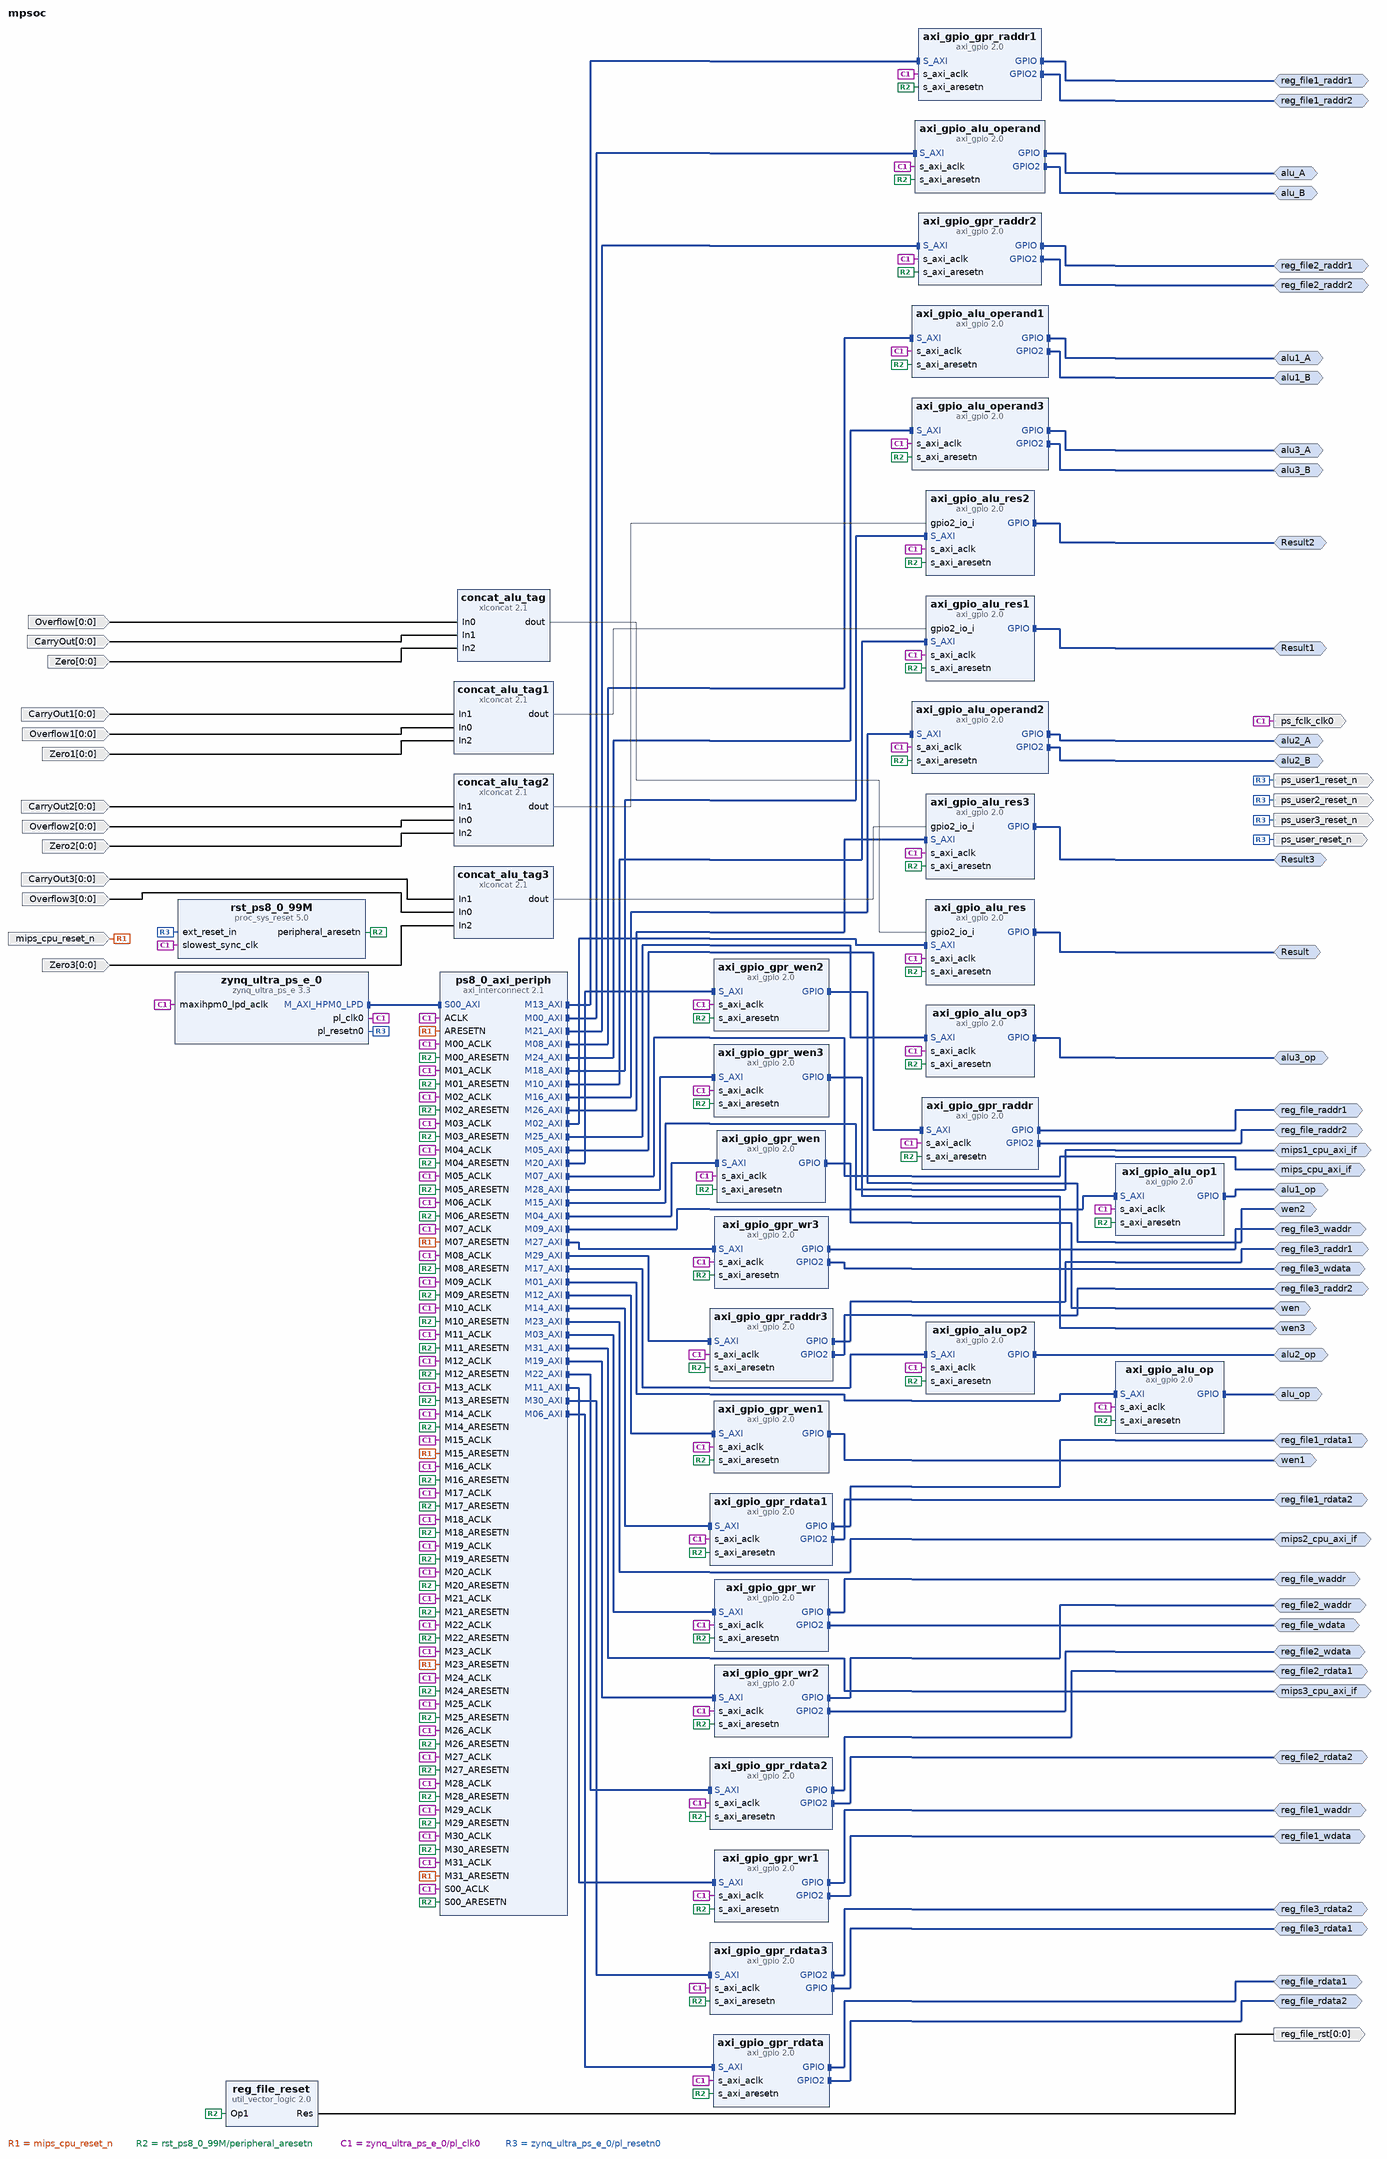
[diagram p0: block diagram of the top level]
# Vivado block design mpsoc, xczu19eg-ffvc1760-2-i, Vivado 2019.1
create_bd_design mpsoc

create_bd_intf_port -mode Master -vlnv xilinx.com:interface:gpio_rtl:1.0 Result
create_bd_intf_port -mode Master -vlnv xilinx.com:interface:gpio_rtl:1.0 Result1
create_bd_intf_port -mode Master -vlnv xilinx.com:interface:gpio_rtl:1.0 Result2
create_bd_intf_port -mode Master -vlnv xilinx.com:interface:gpio_rtl:1.0 Result3
create_bd_intf_port -mode Master -vlnv xilinx.com:interface:gpio_rtl:1.0 alu1_A
create_bd_intf_port -mode Master -vlnv xilinx.com:interface:gpio_rtl:1.0 alu1_B
create_bd_intf_port -mode Master -vlnv xilinx.com:interface:gpio_rtl:1.0 alu1_op
create_bd_intf_port -mode Master -vlnv xilinx.com:interface:gpio_rtl:1.0 alu2_A
create_bd_intf_port -mode Master -vlnv xilinx.com:interface:gpio_rtl:1.0 alu2_B
create_bd_intf_port -mode Master -vlnv xilinx.com:interface:gpio_rtl:1.0 alu2_op
create_bd_intf_port -mode Master -vlnv xilinx.com:interface:gpio_rtl:1.0 alu3_A
create_bd_intf_port -mode Master -vlnv xilinx.com:interface:gpio_rtl:1.0 alu3_B
create_bd_intf_port -mode Master -vlnv xilinx.com:interface:gpio_rtl:1.0 alu3_op
create_bd_intf_port -mode Master -vlnv xilinx.com:interface:gpio_rtl:1.0 alu_A
create_bd_intf_port -mode Master -vlnv xilinx.com:interface:gpio_rtl:1.0 alu_B
create_bd_intf_port -mode Master -vlnv xilinx.com:interface:gpio_rtl:1.0 alu_op
create_bd_intf_port -mode Master -vlnv xilinx.com:interface:aximm_rtl:1.0 mips1_cpu_axi_if
set_property -dict {CONFIG.ADDR_WIDTH 32 CONFIG.DATA_WIDTH 32 CONFIG.PROTOCOL AXI4LITE} [get_bd_intf_ports mips1_cpu_axi_if]
create_bd_intf_port -mode Master -vlnv xilinx.com:interface:aximm_rtl:1.0 mips2_cpu_axi_if
set_property -dict {CONFIG.ADDR_WIDTH 32 CONFIG.DATA_WIDTH 32 CONFIG.PROTOCOL AXI4LITE} [get_bd_intf_ports mips2_cpu_axi_if]
create_bd_intf_port -mode Master -vlnv xilinx.com:interface:aximm_rtl:1.0 mips3_cpu_axi_if
set_property -dict {CONFIG.ADDR_WIDTH 32 CONFIG.DATA_WIDTH 32 CONFIG.PROTOCOL AXI4LITE} [get_bd_intf_ports mips3_cpu_axi_if]
create_bd_intf_port -mode Master -vlnv xilinx.com:interface:aximm_rtl:1.0 mips_cpu_axi_if
set_property -dict {CONFIG.ADDR_WIDTH 32 CONFIG.DATA_WIDTH 32 CONFIG.PROTOCOL AXI4LITE} [get_bd_intf_ports mips_cpu_axi_if]
create_bd_intf_port -mode Master -vlnv xilinx.com:interface:gpio_rtl:1.0 reg_file1_raddr1
create_bd_intf_port -mode Master -vlnv xilinx.com:interface:gpio_rtl:1.0 reg_file1_raddr2
create_bd_intf_port -mode Master -vlnv xilinx.com:interface:gpio_rtl:1.0 reg_file1_rdata1
create_bd_intf_port -mode Master -vlnv xilinx.com:interface:gpio_rtl:1.0 reg_file1_rdata2
create_bd_intf_port -mode Master -vlnv xilinx.com:interface:gpio_rtl:1.0 reg_file1_waddr
create_bd_intf_port -mode Master -vlnv xilinx.com:interface:gpio_rtl:1.0 reg_file1_wdata
create_bd_intf_port -mode Master -vlnv xilinx.com:interface:gpio_rtl:1.0 reg_file2_raddr1
create_bd_intf_port -mode Master -vlnv xilinx.com:interface:gpio_rtl:1.0 reg_file2_raddr2
create_bd_intf_port -mode Master -vlnv xilinx.com:interface:gpio_rtl:1.0 reg_file2_rdata1
create_bd_intf_port -mode Master -vlnv xilinx.com:interface:gpio_rtl:1.0 reg_file2_rdata2
create_bd_intf_port -mode Master -vlnv xilinx.com:interface:gpio_rtl:1.0 reg_file2_waddr
create_bd_intf_port -mode Master -vlnv xilinx.com:interface:gpio_rtl:1.0 reg_file2_wdata
create_bd_intf_port -mode Master -vlnv xilinx.com:interface:gpio_rtl:1.0 reg_file3_raddr1
create_bd_intf_port -mode Master -vlnv xilinx.com:interface:gpio_rtl:1.0 reg_file3_raddr2
create_bd_intf_port -mode Master -vlnv xilinx.com:interface:gpio_rtl:1.0 reg_file3_rdata1
create_bd_intf_port -mode Master -vlnv xilinx.com:interface:gpio_rtl:1.0 reg_file3_rdata2
create_bd_intf_port -mode Master -vlnv xilinx.com:interface:gpio_rtl:1.0 reg_file3_waddr
create_bd_intf_port -mode Master -vlnv xilinx.com:interface:gpio_rtl:1.0 reg_file3_wdata
create_bd_intf_port -mode Master -vlnv xilinx.com:interface:gpio_rtl:1.0 reg_file_raddr1
create_bd_intf_port -mode Master -vlnv xilinx.com:interface:gpio_rtl:1.0 reg_file_raddr2
create_bd_intf_port -mode Master -vlnv xilinx.com:interface:gpio_rtl:1.0 reg_file_rdata1
create_bd_intf_port -mode Master -vlnv xilinx.com:interface:gpio_rtl:1.0 reg_file_rdata2
create_bd_intf_port -mode Master -vlnv xilinx.com:interface:gpio_rtl:1.0 reg_file_waddr
create_bd_intf_port -mode Master -vlnv xilinx.com:interface:gpio_rtl:1.0 reg_file_wdata
create_bd_intf_port -mode Master -vlnv xilinx.com:interface:gpio_rtl:1.0 wen
create_bd_intf_port -mode Master -vlnv xilinx.com:interface:gpio_rtl:1.0 wen1
create_bd_intf_port -mode Master -vlnv xilinx.com:interface:gpio_rtl:1.0 wen2
create_bd_intf_port -mode Master -vlnv xilinx.com:interface:gpio_rtl:1.0 wen3
create_bd_port -dir I -from 0 -to 0 CarryOut
create_bd_port -dir I -from 0 -to 0 CarryOut1
create_bd_port -dir I -from 0 -to 0 CarryOut2
create_bd_port -dir I -from 0 -to 0 CarryOut3
create_bd_port -dir I -from 0 -to 0 Overflow
create_bd_port -dir I -from 0 -to 0 Overflow1
create_bd_port -dir I -from 0 -to 0 Overflow2
create_bd_port -dir I -from 0 -to 0 Overflow3
create_bd_port -dir I -from 0 -to 0 Zero
create_bd_port -dir I -from 0 -to 0 Zero1
create_bd_port -dir I -from 0 -to 0 Zero2
create_bd_port -dir I -from 0 -to 0 Zero3
create_bd_port -dir I -type rst mips_cpu_reset_n
create_bd_port -dir O -type clk ps_fclk_clk0
set_property -dict [list \
  CONFIG.ASSOCIATED_BUSIF mips_cpu_axi_if:mips1_cpu_axi_if:mips2_cpu_axi_if:mips3_cpu_axi_if \
  CONFIG.ASSOCIATED_RESET mips_cpu_reset_n:ps_user_reset_n:ps_user1_reset_n:ps_user2_reset_n:ps_user3_reset_n \
] [get_bd_ports ps_fclk_clk0]
create_bd_port -dir O -type rst ps_user1_reset_n
create_bd_port -dir O -type rst ps_user2_reset_n
create_bd_port -dir O -type rst ps_user3_reset_n
create_bd_port -dir O -type rst ps_user_reset_n
create_bd_port -dir O -from 0 -to 0 reg_file_rst

create_bd_cell -type ip -vlnv xilinx.com:ip:axi_gpio:2.0 axi_gpio_alu_op
set_property -dict {CONFIG.C_ALL_INPUTS 0 CONFIG.C_ALL_OUTPUTS 1 CONFIG.C_GPIO_WIDTH 3} [get_bd_cells axi_gpio_alu_op]
create_bd_cell -type ip -vlnv xilinx.com:ip:axi_gpio:2.0 axi_gpio_alu_op1
set_property -dict {CONFIG.C_ALL_INPUTS 0 CONFIG.C_ALL_OUTPUTS 1 CONFIG.C_GPIO_WIDTH 3} [get_bd_cells axi_gpio_alu_op1]
create_bd_cell -type ip -vlnv xilinx.com:ip:axi_gpio:2.0 axi_gpio_alu_op2
set_property -dict {CONFIG.C_ALL_INPUTS 0 CONFIG.C_ALL_OUTPUTS 1 CONFIG.C_GPIO_WIDTH 3} [get_bd_cells axi_gpio_alu_op2]
create_bd_cell -type ip -vlnv xilinx.com:ip:axi_gpio:2.0 axi_gpio_alu_op3
set_property -dict {CONFIG.C_ALL_INPUTS 0 CONFIG.C_ALL_OUTPUTS 1 CONFIG.C_GPIO_WIDTH 3} [get_bd_cells axi_gpio_alu_op3]
create_bd_cell -type ip -vlnv xilinx.com:ip:axi_gpio:2.0 axi_gpio_alu_operand
set_property -dict [list \
  CONFIG.C_ALL_INPUTS 0 \
  CONFIG.C_ALL_INPUTS_2 0 \
  CONFIG.C_ALL_OUTPUTS 1 \
  CONFIG.C_ALL_OUTPUTS_2 1 \
  CONFIG.C_GPIO2_WIDTH 32 \
  CONFIG.C_GPIO_WIDTH 32 \
  CONFIG.C_IS_DUAL 1 \
] [get_bd_cells axi_gpio_alu_operand]
create_bd_cell -type ip -vlnv xilinx.com:ip:axi_gpio:2.0 axi_gpio_alu_operand1
set_property -dict [list \
  CONFIG.C_ALL_INPUTS 0 \
  CONFIG.C_ALL_INPUTS_2 0 \
  CONFIG.C_ALL_OUTPUTS 1 \
  CONFIG.C_ALL_OUTPUTS_2 1 \
  CONFIG.C_GPIO2_WIDTH 32 \
  CONFIG.C_GPIO_WIDTH 32 \
  CONFIG.C_IS_DUAL 1 \
] [get_bd_cells axi_gpio_alu_operand1]
create_bd_cell -type ip -vlnv xilinx.com:ip:axi_gpio:2.0 axi_gpio_alu_operand2
set_property -dict [list \
  CONFIG.C_ALL_INPUTS 0 \
  CONFIG.C_ALL_INPUTS_2 0 \
  CONFIG.C_ALL_OUTPUTS 1 \
  CONFIG.C_ALL_OUTPUTS_2 1 \
  CONFIG.C_GPIO2_WIDTH 32 \
  CONFIG.C_GPIO_WIDTH 32 \
  CONFIG.C_IS_DUAL 1 \
] [get_bd_cells axi_gpio_alu_operand2]
create_bd_cell -type ip -vlnv xilinx.com:ip:axi_gpio:2.0 axi_gpio_alu_operand3
set_property -dict [list \
  CONFIG.C_ALL_INPUTS 0 \
  CONFIG.C_ALL_INPUTS_2 0 \
  CONFIG.C_ALL_OUTPUTS 1 \
  CONFIG.C_ALL_OUTPUTS_2 1 \
  CONFIG.C_GPIO2_WIDTH 32 \
  CONFIG.C_GPIO_WIDTH 32 \
  CONFIG.C_IS_DUAL 1 \
] [get_bd_cells axi_gpio_alu_operand3]
create_bd_cell -type ip -vlnv xilinx.com:ip:axi_gpio:2.0 axi_gpio_alu_res
set_property -dict [list \
  CONFIG.C_ALL_INPUTS 1 \
  CONFIG.C_ALL_INPUTS_2 1 \
  CONFIG.C_GPIO2_WIDTH 3 \
  CONFIG.C_GPIO_WIDTH 32 \
  CONFIG.C_IS_DUAL 1 \
] [get_bd_cells axi_gpio_alu_res]
create_bd_cell -type ip -vlnv xilinx.com:ip:axi_gpio:2.0 axi_gpio_alu_res1
set_property -dict [list \
  CONFIG.C_ALL_INPUTS 1 \
  CONFIG.C_ALL_INPUTS_2 1 \
  CONFIG.C_GPIO2_WIDTH 3 \
  CONFIG.C_GPIO_WIDTH 32 \
  CONFIG.C_IS_DUAL 1 \
] [get_bd_cells axi_gpio_alu_res1]
create_bd_cell -type ip -vlnv xilinx.com:ip:axi_gpio:2.0 axi_gpio_alu_res2
set_property -dict [list \
  CONFIG.C_ALL_INPUTS 1 \
  CONFIG.C_ALL_INPUTS_2 1 \
  CONFIG.C_GPIO2_WIDTH 3 \
  CONFIG.C_GPIO_WIDTH 32 \
  CONFIG.C_IS_DUAL 1 \
] [get_bd_cells axi_gpio_alu_res2]
create_bd_cell -type ip -vlnv xilinx.com:ip:axi_gpio:2.0 axi_gpio_alu_res3
set_property -dict [list \
  CONFIG.C_ALL_INPUTS 1 \
  CONFIG.C_ALL_INPUTS_2 1 \
  CONFIG.C_GPIO2_WIDTH 3 \
  CONFIG.C_GPIO_WIDTH 32 \
  CONFIG.C_IS_DUAL 1 \
] [get_bd_cells axi_gpio_alu_res3]
create_bd_cell -type ip -vlnv xilinx.com:ip:axi_gpio:2.0 axi_gpio_gpr_raddr
set_property -dict [list \
  CONFIG.C_ALL_INPUTS 0 \
  CONFIG.C_ALL_INPUTS_2 0 \
  CONFIG.C_ALL_OUTPUTS 1 \
  CONFIG.C_ALL_OUTPUTS_2 1 \
  CONFIG.C_GPIO2_WIDTH 5 \
  CONFIG.C_GPIO_WIDTH 5 \
  CONFIG.C_IS_DUAL 1 \
] [get_bd_cells axi_gpio_gpr_raddr]
create_bd_cell -type ip -vlnv xilinx.com:ip:axi_gpio:2.0 axi_gpio_gpr_raddr1
set_property -dict [list \
  CONFIG.C_ALL_INPUTS 0 \
  CONFIG.C_ALL_INPUTS_2 0 \
  CONFIG.C_ALL_OUTPUTS 1 \
  CONFIG.C_ALL_OUTPUTS_2 1 \
  CONFIG.C_GPIO2_WIDTH 5 \
  CONFIG.C_GPIO_WIDTH 5 \
  CONFIG.C_IS_DUAL 1 \
] [get_bd_cells axi_gpio_gpr_raddr1]
create_bd_cell -type ip -vlnv xilinx.com:ip:axi_gpio:2.0 axi_gpio_gpr_raddr2
set_property -dict [list \
  CONFIG.C_ALL_INPUTS 0 \
  CONFIG.C_ALL_INPUTS_2 0 \
  CONFIG.C_ALL_OUTPUTS 1 \
  CONFIG.C_ALL_OUTPUTS_2 1 \
  CONFIG.C_GPIO2_WIDTH 5 \
  CONFIG.C_GPIO_WIDTH 5 \
  CONFIG.C_IS_DUAL 1 \
] [get_bd_cells axi_gpio_gpr_raddr2]
create_bd_cell -type ip -vlnv xilinx.com:ip:axi_gpio:2.0 axi_gpio_gpr_raddr3
set_property -dict [list \
  CONFIG.C_ALL_INPUTS 0 \
  CONFIG.C_ALL_INPUTS_2 0 \
  CONFIG.C_ALL_OUTPUTS 1 \
  CONFIG.C_ALL_OUTPUTS_2 1 \
  CONFIG.C_GPIO2_WIDTH 5 \
  CONFIG.C_GPIO_WIDTH 5 \
  CONFIG.C_IS_DUAL 1 \
] [get_bd_cells axi_gpio_gpr_raddr3]
create_bd_cell -type ip -vlnv xilinx.com:ip:axi_gpio:2.0 axi_gpio_gpr_rdata
set_property -dict [list \
  CONFIG.C_ALL_INPUTS 1 \
  CONFIG.C_ALL_INPUTS_2 1 \
  CONFIG.C_GPIO2_WIDTH 32 \
  CONFIG.C_GPIO_WIDTH 32 \
  CONFIG.C_IS_DUAL 1 \
] [get_bd_cells axi_gpio_gpr_rdata]
create_bd_cell -type ip -vlnv xilinx.com:ip:axi_gpio:2.0 axi_gpio_gpr_rdata1
set_property -dict [list \
  CONFIG.C_ALL_INPUTS 1 \
  CONFIG.C_ALL_INPUTS_2 1 \
  CONFIG.C_GPIO2_WIDTH 32 \
  CONFIG.C_GPIO_WIDTH 32 \
  CONFIG.C_IS_DUAL 1 \
] [get_bd_cells axi_gpio_gpr_rdata1]
create_bd_cell -type ip -vlnv xilinx.com:ip:axi_gpio:2.0 axi_gpio_gpr_rdata2
set_property -dict [list \
  CONFIG.C_ALL_INPUTS 1 \
  CONFIG.C_ALL_INPUTS_2 1 \
  CONFIG.C_GPIO2_WIDTH 32 \
  CONFIG.C_GPIO_WIDTH 32 \
  CONFIG.C_IS_DUAL 1 \
] [get_bd_cells axi_gpio_gpr_rdata2]
create_bd_cell -type ip -vlnv xilinx.com:ip:axi_gpio:2.0 axi_gpio_gpr_rdata3
set_property -dict [list \
  CONFIG.C_ALL_INPUTS 1 \
  CONFIG.C_ALL_INPUTS_2 1 \
  CONFIG.C_GPIO2_WIDTH 32 \
  CONFIG.C_GPIO_WIDTH 32 \
  CONFIG.C_IS_DUAL 1 \
] [get_bd_cells axi_gpio_gpr_rdata3]
create_bd_cell -type ip -vlnv xilinx.com:ip:axi_gpio:2.0 axi_gpio_gpr_wen
set_property -dict {CONFIG.C_ALL_INPUTS 0 CONFIG.C_ALL_OUTPUTS 1 CONFIG.C_GPIO_WIDTH 1} [get_bd_cells axi_gpio_gpr_wen]
create_bd_cell -type ip -vlnv xilinx.com:ip:axi_gpio:2.0 axi_gpio_gpr_wen1
set_property -dict {CONFIG.C_ALL_INPUTS 0 CONFIG.C_ALL_OUTPUTS 1 CONFIG.C_GPIO_WIDTH 1} [get_bd_cells axi_gpio_gpr_wen1]
create_bd_cell -type ip -vlnv xilinx.com:ip:axi_gpio:2.0 axi_gpio_gpr_wen2
set_property -dict {CONFIG.C_ALL_INPUTS 0 CONFIG.C_ALL_OUTPUTS 1 CONFIG.C_GPIO_WIDTH 1} [get_bd_cells axi_gpio_gpr_wen2]
create_bd_cell -type ip -vlnv xilinx.com:ip:axi_gpio:2.0 axi_gpio_gpr_wen3
set_property -dict {CONFIG.C_ALL_INPUTS 0 CONFIG.C_ALL_OUTPUTS 1 CONFIG.C_GPIO_WIDTH 1} [get_bd_cells axi_gpio_gpr_wen3]
create_bd_cell -type ip -vlnv xilinx.com:ip:axi_gpio:2.0 axi_gpio_gpr_wr
set_property -dict [list \
  CONFIG.C_ALL_INPUTS 0 \
  CONFIG.C_ALL_INPUTS_2 0 \
  CONFIG.C_ALL_OUTPUTS 1 \
  CONFIG.C_ALL_OUTPUTS_2 1 \
  CONFIG.C_GPIO2_WIDTH 32 \
  CONFIG.C_GPIO_WIDTH 5 \
  CONFIG.C_IS_DUAL 1 \
] [get_bd_cells axi_gpio_gpr_wr]
create_bd_cell -type ip -vlnv xilinx.com:ip:axi_gpio:2.0 axi_gpio_gpr_wr1
set_property -dict [list \
  CONFIG.C_ALL_INPUTS 0 \
  CONFIG.C_ALL_INPUTS_2 0 \
  CONFIG.C_ALL_OUTPUTS 1 \
  CONFIG.C_ALL_OUTPUTS_2 1 \
  CONFIG.C_GPIO2_WIDTH 32 \
  CONFIG.C_GPIO_WIDTH 5 \
  CONFIG.C_IS_DUAL 1 \
] [get_bd_cells axi_gpio_gpr_wr1]
create_bd_cell -type ip -vlnv xilinx.com:ip:axi_gpio:2.0 axi_gpio_gpr_wr2
set_property -dict [list \
  CONFIG.C_ALL_INPUTS 0 \
  CONFIG.C_ALL_INPUTS_2 0 \
  CONFIG.C_ALL_OUTPUTS 1 \
  CONFIG.C_ALL_OUTPUTS_2 1 \
  CONFIG.C_GPIO2_WIDTH 32 \
  CONFIG.C_GPIO_WIDTH 5 \
  CONFIG.C_IS_DUAL 1 \
] [get_bd_cells axi_gpio_gpr_wr2]
create_bd_cell -type ip -vlnv xilinx.com:ip:axi_gpio:2.0 axi_gpio_gpr_wr3
set_property -dict [list \
  CONFIG.C_ALL_INPUTS 0 \
  CONFIG.C_ALL_INPUTS_2 0 \
  CONFIG.C_ALL_OUTPUTS 1 \
  CONFIG.C_ALL_OUTPUTS_2 1 \
  CONFIG.C_GPIO2_WIDTH 32 \
  CONFIG.C_GPIO_WIDTH 5 \
  CONFIG.C_IS_DUAL 1 \
] [get_bd_cells axi_gpio_gpr_wr3]
create_bd_cell -type ip -vlnv xilinx.com:ip:xlconcat:2.1 concat_alu_tag
set_property -dict {CONFIG.NUM_PORTS 3} [get_bd_cells concat_alu_tag]
create_bd_cell -type ip -vlnv xilinx.com:ip:xlconcat:2.1 concat_alu_tag1
set_property -dict {CONFIG.NUM_PORTS 3} [get_bd_cells concat_alu_tag1]
create_bd_cell -type ip -vlnv xilinx.com:ip:xlconcat:2.1 concat_alu_tag2
set_property -dict {CONFIG.NUM_PORTS 3} [get_bd_cells concat_alu_tag2]
create_bd_cell -type ip -vlnv xilinx.com:ip:xlconcat:2.1 concat_alu_tag3
set_property -dict {CONFIG.NUM_PORTS 3} [get_bd_cells concat_alu_tag3]
create_bd_cell -type ip -vlnv xilinx.com:ip:axi_interconnect:2.1 ps8_0_axi_periph
set_property -dict {CONFIG.NUM_MI 32} [get_bd_cells ps8_0_axi_periph]
create_bd_cell -type ip -vlnv xilinx.com:ip:util_vector_logic:2.0 reg_file_reset
set_property -dict {CONFIG.C_OPERATION not CONFIG.C_SIZE 1} [get_bd_cells reg_file_reset]
create_bd_cell -type ip -vlnv xilinx.com:ip:proc_sys_reset:5.0 rst_ps8_0_99M
create_bd_cell -type ip -vlnv xilinx.com:ip:zynq_ultra_ps_e:3.3 zynq_ultra_ps_e_0
set_property -dict [list \
  CONFIG.PSU_BANK_0_IO_STANDARD LVCMOS33 \
  CONFIG.PSU_BANK_1_IO_STANDARD LVCMOS33 \
  CONFIG.PSU_BANK_2_IO_STANDARD LVCMOS33 \
  CONFIG.PSU_BANK_3_IO_STANDARD LVCMOS33 \
  CONFIG.PSU_USB3__DUAL_CLOCK_ENABLE 1 \
  CONFIG.PSU__CAN1__PERIPHERAL__ENABLE 1 \
  CONFIG.PSU__CAN1__PERIPHERAL__IO {MIO 24 .. 25} \
  CONFIG.PSU__CRF_APB__ACPU_CTRL__FREQMHZ 1200 \
  CONFIG.PSU__CRF_APB__ACPU_CTRL__SRCSEL APLL \
  CONFIG.PSU__CRF_APB__APLL_CTRL__SRCSEL PSS_REF_CLK \
  CONFIG.PSU__CRF_APB__DBG_FPD_CTRL__FREQMHZ 250 \
  CONFIG.PSU__CRF_APB__DBG_FPD_CTRL__SRCSEL IOPLL \
  CONFIG.PSU__CRF_APB__DBG_TRACE_CTRL__FREQMHZ 250 \
  CONFIG.PSU__CRF_APB__DBG_TRACE_CTRL__SRCSEL IOPLL \
  CONFIG.PSU__CRF_APB__DBG_TSTMP_CTRL__FREQMHZ 250 \
  CONFIG.PSU__CRF_APB__DBG_TSTMP_CTRL__SRCSEL IOPLL \
  CONFIG.PSU__CRF_APB__DDR_CTRL__FREQMHZ 1067 \
  CONFIG.PSU__CRF_APB__DDR_CTRL__SRCSEL DPLL \
  CONFIG.PSU__CRF_APB__DPDMA_REF_CTRL__FREQMHZ 600 \
  CONFIG.PSU__CRF_APB__DPDMA_REF_CTRL__SRCSEL DPLL \
  CONFIG.PSU__CRF_APB__DPLL_CTRL__SRCSEL PSS_REF_CLK \
  CONFIG.PSU__CRF_APB__DP_AUDIO_REF_CTRL__SRCSEL RPLL \
  CONFIG.PSU__CRF_APB__DP_STC_REF_CTRL__SRCSEL RPLL \
  CONFIG.PSU__CRF_APB__DP_VIDEO_REF_CTRL__SRCSEL VPLL \
  CONFIG.PSU__CRF_APB__GDMA_REF_CTRL__FREQMHZ 600 \
  CONFIG.PSU__CRF_APB__GDMA_REF_CTRL__SRCSEL APLL \
  CONFIG.PSU__CRF_APB__GPU_REF_CTRL__FREQMHZ 500 \
  CONFIG.PSU__CRF_APB__GPU_REF_CTRL__SRCSEL IOPLL \
  CONFIG.PSU__CRF_APB__TOPSW_LSBUS_CTRL__FREQMHZ 100 \
  CONFIG.PSU__CRF_APB__TOPSW_LSBUS_CTRL__SRCSEL IOPLL \
  CONFIG.PSU__CRF_APB__TOPSW_MAIN_CTRL__FREQMHZ 533.33 \
  CONFIG.PSU__CRF_APB__TOPSW_MAIN_CTRL__SRCSEL VPLL \
  CONFIG.PSU__CRF_APB__VPLL_CTRL__SRCSEL PSS_REF_CLK \
  CONFIG.PSU__CRL_APB__AMS_REF_CTRL__FREQMHZ 52 \
  CONFIG.PSU__CRL_APB__CAN1_REF_CTRL__SRCSEL IOPLL \
  CONFIG.PSU__CRL_APB__CPU_R5_CTRL__FREQMHZ 500 \
  CONFIG.PSU__CRL_APB__CPU_R5_CTRL__SRCSEL IOPLL \
  CONFIG.PSU__CRL_APB__DBG_LPD_CTRL__FREQMHZ 250 \
  CONFIG.PSU__CRL_APB__DBG_LPD_CTRL__SRCSEL IOPLL \
  CONFIG.PSU__CRL_APB__GEM3_REF_CTRL__FREQMHZ 125 \
  CONFIG.PSU__CRL_APB__GEM3_REF_CTRL__SRCSEL IOPLL \
  CONFIG.PSU__CRL_APB__I2C0_REF_CTRL__FREQMHZ 100 \
  CONFIG.PSU__CRL_APB__I2C0_REF_CTRL__SRCSEL IOPLL \
  CONFIG.PSU__CRL_APB__I2C1_REF_CTRL__FREQMHZ 100 \
  CONFIG.PSU__CRL_APB__I2C1_REF_CTRL__SRCSEL IOPLL \
  CONFIG.PSU__CRL_APB__IOPLL_CTRL__SRCSEL PSS_REF_CLK \
  CONFIG.PSU__CRL_APB__IOU_SWITCH_CTRL__FREQMHZ 250 \
  CONFIG.PSU__CRL_APB__IOU_SWITCH_CTRL__SRCSEL IOPLL \
  CONFIG.PSU__CRL_APB__LPD_LSBUS_CTRL__FREQMHZ 100 \
  CONFIG.PSU__CRL_APB__LPD_LSBUS_CTRL__SRCSEL IOPLL \
  CONFIG.PSU__CRL_APB__LPD_SWITCH_CTRL__FREQMHZ 500 \
  CONFIG.PSU__CRL_APB__LPD_SWITCH_CTRL__SRCSEL IOPLL \
  CONFIG.PSU__CRL_APB__PCAP_CTRL__FREQMHZ 167 \
  CONFIG.PSU__CRL_APB__PCAP_CTRL__SRCSEL IOPLL \
  CONFIG.PSU__CRL_APB__QSPI_REF_CTRL__FREQMHZ 125 \
  CONFIG.PSU__CRL_APB__QSPI_REF_CTRL__SRCSEL IOPLL \
  CONFIG.PSU__CRL_APB__RPLL_CTRL__SRCSEL PSS_REF_CLK \
  CONFIG.PSU__CRL_APB__SDIO1_REF_CTRL__FREQMHZ 200 \
  CONFIG.PSU__CRL_APB__SDIO1_REF_CTRL__SRCSEL IOPLL \
  CONFIG.PSU__CRL_APB__TIMESTAMP_REF_CTRL__FREQMHZ 100 \
  CONFIG.PSU__CRL_APB__TIMESTAMP_REF_CTRL__SRCSEL IOPLL \
  CONFIG.PSU__CRL_APB__UART0_REF_CTRL__FREQMHZ 100 \
  CONFIG.PSU__CRL_APB__UART0_REF_CTRL__SRCSEL IOPLL \
  CONFIG.PSU__CRL_APB__UART1_REF_CTRL__FREQMHZ 100 \
  CONFIG.PSU__CRL_APB__UART1_REF_CTRL__SRCSEL IOPLL \
  CONFIG.PSU__CRL_APB__USB3__ENABLE 1 \
  CONFIG.PSU__CSUPMU__PERIPHERAL__VALID 0 \
  CONFIG.PSU__DDRC__BUS_WIDTH {64 Bit} \
  CONFIG.PSU__DDRC__COMPONENTS UDIMM \
  CONFIG.PSU__DDRC__DEVICE_CAPACITY {8192 MBits} \
  CONFIG.PSU__DDRC__DRAM_WIDTH {8 Bits} \
  CONFIG.PSU__DDRC__ECC Disabled \
  CONFIG.PSU__DDRC__MEMORY_TYPE {DDR 4} \
  CONFIG.PSU__DDRC__SPEED_BIN DDR4_2133P \
  CONFIG.PSU__DDR_HIGH_ADDRESS_GUI_ENABLE 1 \
  CONFIG.PSU__DDR__INTERFACE__FREQMHZ 533.500 \
  CONFIG.PSU__DISPLAYPORT__LANE0__ENABLE 1 \
  CONFIG.PSU__DISPLAYPORT__LANE0__IO {GT Lane1} \
  CONFIG.PSU__DISPLAYPORT__LANE1__ENABLE 0 \
  CONFIG.PSU__DISPLAYPORT__PERIPHERAL__ENABLE 1 \
  CONFIG.PSU__DLL__ISUSED 1 \
  CONFIG.PSU__DPAUX__PERIPHERAL__ENABLE 1 \
  CONFIG.PSU__DPAUX__PERIPHERAL__IO {MIO 27 .. 30} \
  CONFIG.PSU__DP__LANE_SEL {Single Lower} \
  CONFIG.PSU__DP__REF_CLK_FREQ 27 \
  CONFIG.PSU__DP__REF_CLK_SEL {Ref Clk3} \
  CONFIG.PSU__ENET3__FIFO__ENABLE 0 \
  CONFIG.PSU__ENET3__GRP_MDIO__ENABLE 1 \
  CONFIG.PSU__ENET3__GRP_MDIO__IO {MIO 76 .. 77} \
  CONFIG.PSU__ENET3__PERIPHERAL__ENABLE 1 \
  CONFIG.PSU__ENET3__PERIPHERAL__IO {MIO 64 .. 75} \
  CONFIG.PSU__ENET3__PTP__ENABLE 0 \
  CONFIG.PSU__ENET3__TSU__ENABLE 0 \
  CONFIG.PSU__GEM3_COHERENCY 0 \
  CONFIG.PSU__GEM3_ROUTE_THROUGH_FPD 0 \
  CONFIG.PSU__GEM__TSU__ENABLE 0 \
  CONFIG.PSU__GPIO0_MIO__IO {MIO 0 .. 25} \
  CONFIG.PSU__GPIO0_MIO__PERIPHERAL__ENABLE 1 \
  CONFIG.PSU__GPIO1_MIO__IO {MIO 26 .. 51} \
  CONFIG.PSU__GPIO1_MIO__PERIPHERAL__ENABLE 1 \
  CONFIG.PSU__GPIO2_MIO__IO {MIO 52 .. 77} \
  CONFIG.PSU__GPIO2_MIO__PERIPHERAL__ENABLE 1 \
  CONFIG.PSU__GT__LINK_SPEED HBR \
  CONFIG.PSU__GT__PRE_EMPH_LVL_4 0 \
  CONFIG.PSU__GT__VLT_SWNG_LVL_4 0 \
  CONFIG.PSU__I2C0__PERIPHERAL__ENABLE 1 \
  CONFIG.PSU__I2C0__PERIPHERAL__IO {MIO 14 .. 15} \
  CONFIG.PSU__I2C1__PERIPHERAL__ENABLE 1 \
  CONFIG.PSU__I2C1__PERIPHERAL__IO {MIO 16 .. 17} \
  CONFIG.PSU__OVERRIDE__BASIC_CLOCK 0 \
  CONFIG.PSU__PCIE__BAR0_VAL 0x0 \
  CONFIG.PSU__PCIE__BAR1_VAL 0x0 \
  CONFIG.PSU__PCIE__BAR2_VAL 0x0 \
  CONFIG.PSU__PCIE__BAR3_VAL 0x0 \
  CONFIG.PSU__PCIE__BAR4_VAL 0x0 \
  CONFIG.PSU__PCIE__BAR5_VAL 0x0 \
  CONFIG.PSU__PCIE__CLASS_CODE_BASE 0x06 \
  CONFIG.PSU__PCIE__CLASS_CODE_INTERFACE 0x0 \
  CONFIG.PSU__PCIE__CLASS_CODE_SUB 0x4 \
  CONFIG.PSU__PCIE__CLASS_CODE_VALUE 0x60400 \
  CONFIG.PSU__PCIE__DEVICE_ID 0xD021 \
  CONFIG.PSU__PCIE__DEVICE_PORT_TYPE {Root Port} \
  CONFIG.PSU__PCIE__EROM_VAL 0x0 \
  CONFIG.PSU__PCIE__LANE0__ENABLE 1 \
  CONFIG.PSU__PCIE__LANE0__IO {GT Lane0} \
  CONFIG.PSU__PCIE__LINK_SPEED {5.0 Gb/s} \
  CONFIG.PSU__PCIE__MAXIMUM_LINK_WIDTH x1 \
  CONFIG.PSU__PCIE__MAX_PAYLOAD_SIZE {256 bytes} \
  CONFIG.PSU__PCIE__PERIPHERAL__ENABLE 1 \
  CONFIG.PSU__PCIE__PERIPHERAL__ENDPOINT_ENABLE 0 \
  CONFIG.PSU__PCIE__PERIPHERAL__ROOTPORT_ENABLE 1 \
  CONFIG.PSU__PCIE__PERIPHERAL__ROOTPORT_IO {MIO 31} \
  CONFIG.PSU__PCIE__REF_CLK_FREQ 100 \
  CONFIG.PSU__PCIE__REF_CLK_SEL {Ref Clk0} \
  CONFIG.PSU__PCIE__REVISION_ID 0x0 \
  CONFIG.PSU__PCIE__SUBSYSTEM_ID 0x7 \
  CONFIG.PSU__PCIE__SUBSYSTEM_VENDOR_ID 0x10EE \
  CONFIG.PSU__PCIE__VENDOR_ID 0x10EE \
  CONFIG.PSU__PSS_REF_CLK__FREQMHZ 33.333 \
  CONFIG.PSU__QSPI_COHERENCY 0 \
  CONFIG.PSU__QSPI_ROUTE_THROUGH_FPD 0 \
  CONFIG.PSU__QSPI__GRP_FBCLK__ENABLE 1 \
  CONFIG.PSU__QSPI__GRP_FBCLK__IO {MIO 6} \
  CONFIG.PSU__QSPI__PERIPHERAL__DATA_MODE x4 \
  CONFIG.PSU__QSPI__PERIPHERAL__ENABLE 1 \
  CONFIG.PSU__QSPI__PERIPHERAL__IO {MIO 0 .. 12} \
  CONFIG.PSU__QSPI__PERIPHERAL__MODE {Dual Parallel} \
  CONFIG.PSU__SATA__LANE1__IO {GT Lane3} \
  CONFIG.PSU__SATA__PERIPHERAL__ENABLE 1 \
  CONFIG.PSU__SATA__REF_CLK_FREQ 125 \
  CONFIG.PSU__SATA__REF_CLK_SEL {Ref Clk1} \
  CONFIG.PSU__SD1_COHERENCY 0 \
  CONFIG.PSU__SD1_ROUTE_THROUGH_FPD 0 \
  CONFIG.PSU__SD1__DATA_TRANSFER_MODE 8Bit \
  CONFIG.PSU__SD1__GRP_CD__ENABLE 1 \
  CONFIG.PSU__SD1__GRP_CD__IO {MIO 45} \
  CONFIG.PSU__SD1__GRP_POW__ENABLE 0 \
  CONFIG.PSU__SD1__GRP_WP__ENABLE 1 \
  CONFIG.PSU__SD1__GRP_WP__IO {MIO 44} \
  CONFIG.PSU__SD1__PERIPHERAL__ENABLE 1 \
  CONFIG.PSU__SD1__PERIPHERAL__IO {MIO 39 .. 51} \
  CONFIG.PSU__SD1__SLOT_TYPE {SD 3.0} \
  CONFIG.PSU__TSU__BUFG_PORT_PAIR 0 \
  CONFIG.PSU__TTC0__CLOCK__ENABLE 0 \
  CONFIG.PSU__TTC0__PERIPHERAL__ENABLE 1 \
  CONFIG.PSU__TTC0__WAVEOUT__ENABLE 0 \
  CONFIG.PSU__TTC1__CLOCK__ENABLE 0 \
  CONFIG.PSU__TTC1__PERIPHERAL__ENABLE 1 \
  CONFIG.PSU__TTC1__WAVEOUT__ENABLE 0 \
  CONFIG.PSU__TTC2__CLOCK__ENABLE 0 \
  CONFIG.PSU__TTC2__PERIPHERAL__ENABLE 1 \
  CONFIG.PSU__TTC2__WAVEOUT__ENABLE 0 \
  CONFIG.PSU__TTC3__CLOCK__ENABLE 0 \
  CONFIG.PSU__TTC3__PERIPHERAL__ENABLE 1 \
  CONFIG.PSU__TTC3__WAVEOUT__ENABLE 0 \
  CONFIG.PSU__UART0__BAUD_RATE 115200 \
  CONFIG.PSU__UART0__MODEM__ENABLE 0 \
  CONFIG.PSU__UART0__PERIPHERAL__ENABLE 1 \
  CONFIG.PSU__UART0__PERIPHERAL__IO {MIO 18 .. 19} \
  CONFIG.PSU__UART1__BAUD_RATE 115200 \
  CONFIG.PSU__UART1__MODEM__ENABLE 0 \
  CONFIG.PSU__UART1__PERIPHERAL__ENABLE 1 \
  CONFIG.PSU__UART1__PERIPHERAL__IO {MIO 20 .. 21} \
  CONFIG.PSU__USB0_COHERENCY 0 \
  CONFIG.PSU__USB0__PERIPHERAL__ENABLE 1 \
  CONFIG.PSU__USB0__PERIPHERAL__IO {MIO 52 .. 63} \
  CONFIG.PSU__USB0__REF_CLK_FREQ 26 \
  CONFIG.PSU__USB0__REF_CLK_SEL {Ref Clk2} \
  CONFIG.PSU__USB2_0__EMIO__ENABLE 0 \
  CONFIG.PSU__USB3_0__EMIO__ENABLE 0 \
  CONFIG.PSU__USB3_0__PERIPHERAL__ENABLE 1 \
  CONFIG.PSU__USB3_0__PERIPHERAL__IO {GT Lane2} \
  CONFIG.PSU__USB__RESET__MODE {Boot Pin} \
  CONFIG.PSU__USB__RESET__POLARITY {Active Low} \
  CONFIG.PSU__USE__IRQ0 0 \
  CONFIG.PSU__USE__M_AXI_GP2 1 \
  CONFIG.SUBPRESET1 Custom \
] [get_bd_cells zynq_ultra_ps_e_0]
# 139 more settings of zynq_ultra_ps_e_0 are not shown: defaults, MIO pin electricals, DDR timing, and values the tool derives

# ---- connections ----

connect_bd_intf_net [get_bd_intf_ports reg_file2_raddr2] [get_bd_intf_pins axi_gpio_gpr_raddr2/GPIO2]
connect_bd_intf_net [get_bd_intf_ports reg_file1_raddr1] [get_bd_intf_pins axi_gpio_gpr_raddr1/GPIO]
connect_bd_intf_net [get_bd_intf_ports alu_B] [get_bd_intf_pins axi_gpio_alu_operand/GPIO2]
connect_bd_intf_net [get_bd_intf_ports alu1_A] [get_bd_intf_pins axi_gpio_alu_operand1/GPIO]
connect_bd_intf_net [get_bd_intf_ports alu_A] [get_bd_intf_pins axi_gpio_alu_operand/GPIO]
connect_bd_intf_net [get_bd_intf_ports alu3_A] [get_bd_intf_pins axi_gpio_alu_operand3/GPIO]
connect_bd_intf_net [get_bd_intf_ports alu2_B] [get_bd_intf_pins axi_gpio_alu_operand2/GPIO2]
connect_bd_intf_net [get_bd_intf_ports alu1_B] [get_bd_intf_pins axi_gpio_alu_operand1/GPIO2]
connect_bd_intf_net [get_bd_intf_ports reg_file1_raddr2] [get_bd_intf_pins axi_gpio_gpr_raddr1/GPIO2]
connect_bd_intf_net [get_bd_intf_ports alu2_op] [get_bd_intf_pins axi_gpio_alu_op2/GPIO]
connect_bd_intf_net [get_bd_intf_ports Result2] [get_bd_intf_pins axi_gpio_alu_res2/GPIO]
connect_bd_intf_net [get_bd_intf_ports alu2_A] [get_bd_intf_pins axi_gpio_alu_operand2/GPIO]
connect_bd_intf_net [get_bd_intf_ports alu_op] [get_bd_intf_pins axi_gpio_alu_op/GPIO]
connect_bd_intf_net [get_bd_intf_ports alu3_op] [get_bd_intf_pins axi_gpio_alu_op3/GPIO]
connect_bd_intf_net [get_bd_intf_ports Result1] [get_bd_intf_pins axi_gpio_alu_res1/GPIO]
connect_bd_intf_net [get_bd_intf_ports alu1_op] [get_bd_intf_pins axi_gpio_alu_op1/GPIO]
connect_bd_intf_net [get_bd_intf_ports alu3_B] [get_bd_intf_pins axi_gpio_alu_operand3/GPIO2]
connect_bd_intf_net [get_bd_intf_ports reg_file2_raddr1] [get_bd_intf_pins axi_gpio_gpr_raddr2/GPIO]
connect_bd_intf_net [get_bd_intf_ports reg_file_raddr2] [get_bd_intf_pins axi_gpio_gpr_raddr/GPIO2]
connect_bd_intf_net [get_bd_intf_ports reg_file3_raddr2] [get_bd_intf_pins axi_gpio_gpr_raddr3/GPIO2]
connect_bd_intf_net [get_bd_intf_ports reg_file1_rdata1] [get_bd_intf_pins axi_gpio_gpr_rdata1/GPIO]
connect_bd_intf_net [get_bd_intf_ports reg_file_raddr1] [get_bd_intf_pins axi_gpio_gpr_raddr/GPIO]
connect_bd_intf_net [get_bd_intf_ports Result] [get_bd_intf_pins axi_gpio_alu_res/GPIO]
connect_bd_intf_net [get_bd_intf_ports reg_file3_raddr1] [get_bd_intf_pins axi_gpio_gpr_raddr3/GPIO]
connect_bd_intf_net [get_bd_intf_ports Result3] [get_bd_intf_pins axi_gpio_alu_res3/GPIO]
connect_bd_intf_net [get_bd_intf_ports mips_cpu_axi_if] [get_bd_intf_pins ps8_0_axi_periph/M07_AXI]
connect_bd_intf_net [get_bd_intf_ports mips1_cpu_axi_if] [get_bd_intf_pins ps8_0_axi_periph/M15_AXI]
connect_bd_intf_net [get_bd_intf_ports wen2] [get_bd_intf_pins axi_gpio_gpr_wen2/GPIO]
connect_bd_intf_net [get_bd_intf_ports reg_file3_rdata2] [get_bd_intf_pins axi_gpio_gpr_rdata3/GPIO2]
connect_bd_intf_net [get_bd_intf_pins axi_gpio_alu_res1/S_AXI] [get_bd_intf_pins ps8_0_axi_periph/M10_AXI]
connect_bd_intf_net [get_bd_intf_ports reg_file_waddr] [get_bd_intf_pins axi_gpio_gpr_wr/GPIO]
connect_bd_intf_net [get_bd_intf_pins axi_gpio_alu_op/S_AXI] [get_bd_intf_pins ps8_0_axi_periph/M01_AXI]
connect_bd_intf_net [get_bd_intf_ports reg_file3_waddr] [get_bd_intf_pins axi_gpio_gpr_wr3/GPIO]
connect_bd_intf_net [get_bd_intf_ports reg_file2_wdata] [get_bd_intf_pins axi_gpio_gpr_wr2/GPIO2]
connect_bd_intf_net [get_bd_intf_ports wen3] [get_bd_intf_pins axi_gpio_gpr_wen3/GPIO]
connect_bd_intf_net [get_bd_intf_pins axi_gpio_gpr_rdata1/S_AXI] [get_bd_intf_pins ps8_0_axi_periph/M14_AXI]
connect_bd_intf_net [get_bd_intf_ports reg_file2_rdata1] [get_bd_intf_pins axi_gpio_gpr_rdata2/GPIO]
connect_bd_intf_net [get_bd_intf_ports reg_file3_wdata] [get_bd_intf_pins axi_gpio_gpr_wr3/GPIO2]
connect_bd_intf_net [get_bd_intf_pins axi_gpio_gpr_wr1/S_AXI] [get_bd_intf_pins ps8_0_axi_periph/M11_AXI]
connect_bd_intf_net [get_bd_intf_ports reg_file2_rdata2] [get_bd_intf_pins axi_gpio_gpr_rdata2/GPIO2]
connect_bd_intf_net [get_bd_intf_ports reg_file_wdata] [get_bd_intf_pins axi_gpio_gpr_wr/GPIO2]
connect_bd_intf_net [get_bd_intf_pins axi_gpio_gpr_wr/S_AXI] [get_bd_intf_pins ps8_0_axi_periph/M03_AXI]
connect_bd_intf_net [get_bd_intf_pins axi_gpio_alu_op1/S_AXI] [get_bd_intf_pins ps8_0_axi_periph/M09_AXI]
connect_bd_intf_net [get_bd_intf_ports wen] [get_bd_intf_pins axi_gpio_gpr_wen/GPIO]
connect_bd_intf_net [get_bd_intf_pins axi_gpio_gpr_wen/S_AXI] [get_bd_intf_pins ps8_0_axi_periph/M04_AXI]
connect_bd_intf_net [get_bd_intf_pins axi_gpio_gpr_wen1/S_AXI] [get_bd_intf_pins ps8_0_axi_periph/M12_AXI]
connect_bd_intf_net [get_bd_intf_pins axi_gpio_gpr_raddr1/S_AXI] [get_bd_intf_pins ps8_0_axi_periph/M13_AXI]
connect_bd_intf_net [get_bd_intf_pins axi_gpio_alu_operand/S_AXI] [get_bd_intf_pins ps8_0_axi_periph/M00_AXI]
connect_bd_intf_net [get_bd_intf_ports reg_file1_rdata2] [get_bd_intf_pins axi_gpio_gpr_rdata1/GPIO2]
connect_bd_intf_net [get_bd_intf_pins axi_gpio_alu_res/S_AXI] [get_bd_intf_pins ps8_0_axi_periph/M02_AXI]
connect_bd_intf_net [get_bd_intf_ports reg_file1_waddr] [get_bd_intf_pins axi_gpio_gpr_wr1/GPIO]
connect_bd_intf_net [get_bd_intf_pins axi_gpio_alu_operand1/S_AXI] [get_bd_intf_pins ps8_0_axi_periph/M08_AXI]
connect_bd_intf_net [get_bd_intf_ports reg_file_rdata1] [get_bd_intf_pins axi_gpio_gpr_rdata/GPIO]
connect_bd_intf_net [get_bd_intf_ports reg_file_rdata2] [get_bd_intf_pins axi_gpio_gpr_rdata/GPIO2]
connect_bd_intf_net [get_bd_intf_pins axi_gpio_gpr_raddr/S_AXI] [get_bd_intf_pins ps8_0_axi_periph/M05_AXI]
connect_bd_intf_net [get_bd_intf_pins axi_gpio_gpr_rdata/S_AXI] [get_bd_intf_pins ps8_0_axi_periph/M06_AXI]
connect_bd_intf_net [get_bd_intf_ports reg_file1_wdata] [get_bd_intf_pins axi_gpio_gpr_wr1/GPIO2]
connect_bd_intf_net [get_bd_intf_ports wen1] [get_bd_intf_pins axi_gpio_gpr_wen1/GPIO]
connect_bd_intf_net [get_bd_intf_ports reg_file3_rdata1] [get_bd_intf_pins axi_gpio_gpr_rdata3/GPIO]
connect_bd_intf_net [get_bd_intf_ports reg_file2_waddr] [get_bd_intf_pins axi_gpio_gpr_wr2/GPIO]
connect_bd_intf_net [get_bd_intf_ports mips2_cpu_axi_if] [get_bd_intf_pins ps8_0_axi_periph/M23_AXI]
connect_bd_intf_net [get_bd_intf_pins axi_gpio_gpr_wen3/S_AXI] [get_bd_intf_pins ps8_0_axi_periph/M28_AXI]
connect_bd_intf_net [get_bd_intf_pins axi_gpio_alu_op2/S_AXI] [get_bd_intf_pins ps8_0_axi_periph/M17_AXI]
connect_bd_intf_net [get_bd_intf_pins axi_gpio_alu_op3/S_AXI] [get_bd_intf_pins ps8_0_axi_periph/M25_AXI]
connect_bd_intf_net [get_bd_intf_pins axi_gpio_gpr_rdata2/S_AXI] [get_bd_intf_pins ps8_0_axi_periph/M22_AXI]
connect_bd_intf_net [get_bd_intf_pins axi_gpio_gpr_raddr3/S_AXI] [get_bd_intf_pins ps8_0_axi_periph/M29_AXI]
connect_bd_intf_net [get_bd_intf_pins axi_gpio_alu_res3/S_AXI] [get_bd_intf_pins ps8_0_axi_periph/M26_AXI]
connect_bd_intf_net [get_bd_intf_pins axi_gpio_gpr_rdata3/S_AXI] [get_bd_intf_pins ps8_0_axi_periph/M30_AXI]
connect_bd_intf_net [get_bd_intf_pins axi_gpio_alu_res2/S_AXI] [get_bd_intf_pins ps8_0_axi_periph/M18_AXI]
connect_bd_intf_net [get_bd_intf_pins ps8_0_axi_periph/S00_AXI] [get_bd_intf_pins zynq_ultra_ps_e_0/M_AXI_HPM0_LPD]
connect_bd_intf_net [get_bd_intf_ports mips3_cpu_axi_if] [get_bd_intf_pins ps8_0_axi_periph/M31_AXI]
connect_bd_intf_net [get_bd_intf_pins axi_gpio_alu_operand3/S_AXI] [get_bd_intf_pins ps8_0_axi_periph/M24_AXI]
connect_bd_intf_net [get_bd_intf_pins axi_gpio_alu_operand2/S_AXI] [get_bd_intf_pins ps8_0_axi_periph/M16_AXI]
connect_bd_intf_net [get_bd_intf_pins axi_gpio_gpr_wr3/S_AXI] [get_bd_intf_pins ps8_0_axi_periph/M27_AXI]
connect_bd_intf_net [get_bd_intf_pins axi_gpio_gpr_wr2/S_AXI] [get_bd_intf_pins ps8_0_axi_periph/M19_AXI]
connect_bd_intf_net [get_bd_intf_pins axi_gpio_gpr_wen2/S_AXI] [get_bd_intf_pins ps8_0_axi_periph/M20_AXI]
connect_bd_intf_net [get_bd_intf_pins axi_gpio_gpr_raddr2/S_AXI] [get_bd_intf_pins ps8_0_axi_periph/M21_AXI]
connect_bd_net -net CarryOut1_1 [get_bd_ports CarryOut1] [get_bd_pins concat_alu_tag1/In1]
connect_bd_net -net CarryOut2_1 [get_bd_ports CarryOut2] [get_bd_pins concat_alu_tag2/In1]
connect_bd_net -net CarryOut3_1 [get_bd_ports CarryOut3] [get_bd_pins concat_alu_tag3/In1]
connect_bd_net -net In0_0_1 [get_bd_ports Overflow] [get_bd_pins concat_alu_tag/In0]
connect_bd_net -net In1_0_1 [get_bd_ports CarryOut] [get_bd_pins concat_alu_tag/In1]
connect_bd_net -net In2_0_1 [get_bd_ports Zero] [get_bd_pins concat_alu_tag/In2]
connect_bd_net -net M07_ARESETN_1 [get_bd_ports mips_cpu_reset_n] \
  [get_bd_pins ps8_0_axi_periph/ARESETN] [get_bd_pins ps8_0_axi_periph/M07_ARESETN] \
  [get_bd_pins ps8_0_axi_periph/M15_ARESETN] [get_bd_pins ps8_0_axi_periph/M23_ARESETN] \
  [get_bd_pins ps8_0_axi_periph/M31_ARESETN]
connect_bd_net -net Overflow1_1 [get_bd_ports Overflow1] [get_bd_pins concat_alu_tag1/In0]
connect_bd_net -net Overflow2_1 [get_bd_ports Overflow2] [get_bd_pins concat_alu_tag2/In0]
connect_bd_net -net Overflow3_1 [get_bd_ports Overflow3] [get_bd_pins concat_alu_tag3/In0]
connect_bd_net -net Zero1_1 [get_bd_ports Zero1] [get_bd_pins concat_alu_tag1/In2]
connect_bd_net -net Zero2_1 [get_bd_ports Zero2] [get_bd_pins concat_alu_tag2/In2]
connect_bd_net -net Zero3_1 [get_bd_ports Zero3] [get_bd_pins concat_alu_tag3/In2]
connect_bd_net [get_bd_pins concat_alu_tag1/dout] [get_bd_pins axi_gpio_alu_res1/gpio2_io_i]
connect_bd_net [get_bd_pins concat_alu_tag2/dout] [get_bd_pins axi_gpio_alu_res2/gpio2_io_i]
connect_bd_net [get_bd_pins concat_alu_tag3/dout] [get_bd_pins axi_gpio_alu_res3/gpio2_io_i]
connect_bd_net [get_bd_pins concat_alu_tag/dout] [get_bd_pins axi_gpio_alu_res/gpio2_io_i]
connect_bd_net [get_bd_pins reg_file_reset/Res] [get_bd_ports reg_file_rst]
connect_bd_net [get_bd_pins rst_ps8_0_99M/peripheral_aresetn] \
  [get_bd_pins axi_gpio_alu_op/s_axi_aresetn] [get_bd_pins axi_gpio_alu_op1/s_axi_aresetn] \
  [get_bd_pins axi_gpio_alu_op2/s_axi_aresetn] [get_bd_pins axi_gpio_alu_op3/s_axi_aresetn] \
  [get_bd_pins axi_gpio_alu_operand/s_axi_aresetn] [get_bd_pins axi_gpio_alu_operand1/s_axi_aresetn] \
  [get_bd_pins axi_gpio_alu_operand2/s_axi_aresetn] [get_bd_pins axi_gpio_alu_operand3/s_axi_aresetn] \
  [get_bd_pins axi_gpio_alu_res/s_axi_aresetn] [get_bd_pins axi_gpio_alu_res1/s_axi_aresetn] \
  [get_bd_pins axi_gpio_alu_res2/s_axi_aresetn] [get_bd_pins axi_gpio_alu_res3/s_axi_aresetn] \
  [get_bd_pins axi_gpio_gpr_raddr/s_axi_aresetn] [get_bd_pins axi_gpio_gpr_raddr1/s_axi_aresetn] \
  [get_bd_pins axi_gpio_gpr_raddr2/s_axi_aresetn] [get_bd_pins axi_gpio_gpr_raddr3/s_axi_aresetn] \
  [get_bd_pins axi_gpio_gpr_rdata/s_axi_aresetn] [get_bd_pins axi_gpio_gpr_rdata1/s_axi_aresetn] \
  [get_bd_pins axi_gpio_gpr_rdata2/s_axi_aresetn] [get_bd_pins axi_gpio_gpr_rdata3/s_axi_aresetn] \
  [get_bd_pins axi_gpio_gpr_wen/s_axi_aresetn] [get_bd_pins axi_gpio_gpr_wen1/s_axi_aresetn] \
  [get_bd_pins axi_gpio_gpr_wen2/s_axi_aresetn] [get_bd_pins axi_gpio_gpr_wen3/s_axi_aresetn] \
  [get_bd_pins axi_gpio_gpr_wr/s_axi_aresetn] [get_bd_pins axi_gpio_gpr_wr1/s_axi_aresetn] \
  [get_bd_pins axi_gpio_gpr_wr2/s_axi_aresetn] [get_bd_pins axi_gpio_gpr_wr3/s_axi_aresetn] \
  [get_bd_pins ps8_0_axi_periph/M00_ARESETN] [get_bd_pins ps8_0_axi_periph/M01_ARESETN] \
  [get_bd_pins ps8_0_axi_periph/M02_ARESETN] [get_bd_pins ps8_0_axi_periph/M03_ARESETN] \
  [get_bd_pins ps8_0_axi_periph/M04_ARESETN] [get_bd_pins ps8_0_axi_periph/M05_ARESETN] \
  [get_bd_pins ps8_0_axi_periph/M06_ARESETN] [get_bd_pins ps8_0_axi_periph/M08_ARESETN] \
  [get_bd_pins ps8_0_axi_periph/M09_ARESETN] [get_bd_pins ps8_0_axi_periph/M10_ARESETN] \
  [get_bd_pins ps8_0_axi_periph/M11_ARESETN] [get_bd_pins ps8_0_axi_periph/M12_ARESETN] \
  [get_bd_pins ps8_0_axi_periph/M13_ARESETN] [get_bd_pins ps8_0_axi_periph/M14_ARESETN] \
  [get_bd_pins ps8_0_axi_periph/M16_ARESETN] [get_bd_pins ps8_0_axi_periph/M17_ARESETN] \
  [get_bd_pins ps8_0_axi_periph/M18_ARESETN] [get_bd_pins ps8_0_axi_periph/M19_ARESETN] \
  [get_bd_pins ps8_0_axi_periph/M20_ARESETN] [get_bd_pins ps8_0_axi_periph/M21_ARESETN] \
  [get_bd_pins ps8_0_axi_periph/M22_ARESETN] [get_bd_pins ps8_0_axi_periph/M24_ARESETN] \
  [get_bd_pins ps8_0_axi_periph/M25_ARESETN] [get_bd_pins ps8_0_axi_periph/M26_ARESETN] \
  [get_bd_pins ps8_0_axi_periph/M27_ARESETN] [get_bd_pins ps8_0_axi_periph/M28_ARESETN] \
  [get_bd_pins ps8_0_axi_periph/M29_ARESETN] [get_bd_pins ps8_0_axi_periph/M30_ARESETN] \
  [get_bd_pins ps8_0_axi_periph/S00_ARESETN] [get_bd_pins reg_file_reset/Op1]
connect_bd_net [get_bd_pins zynq_ultra_ps_e_0/pl_clk0] \
  [get_bd_ports ps_fclk_clk0] [get_bd_pins axi_gpio_alu_op/s_axi_aclk] [get_bd_pins axi_gpio_alu_op1/s_axi_aclk] \
  [get_bd_pins axi_gpio_alu_op2/s_axi_aclk] [get_bd_pins axi_gpio_alu_op3/s_axi_aclk] \
  [get_bd_pins axi_gpio_alu_operand/s_axi_aclk] [get_bd_pins axi_gpio_alu_operand1/s_axi_aclk] \
  [get_bd_pins axi_gpio_alu_operand2/s_axi_aclk] [get_bd_pins axi_gpio_alu_operand3/s_axi_aclk] \
  [get_bd_pins axi_gpio_alu_res/s_axi_aclk] [get_bd_pins axi_gpio_alu_res1/s_axi_aclk] \
  [get_bd_pins axi_gpio_alu_res2/s_axi_aclk] [get_bd_pins axi_gpio_alu_res3/s_axi_aclk] \
  [get_bd_pins axi_gpio_gpr_raddr/s_axi_aclk] [get_bd_pins axi_gpio_gpr_raddr1/s_axi_aclk] \
  [get_bd_pins axi_gpio_gpr_raddr2/s_axi_aclk] [get_bd_pins axi_gpio_gpr_raddr3/s_axi_aclk] \
  [get_bd_pins axi_gpio_gpr_rdata/s_axi_aclk] [get_bd_pins axi_gpio_gpr_rdata1/s_axi_aclk] \
  [get_bd_pins axi_gpio_gpr_rdata2/s_axi_aclk] [get_bd_pins axi_gpio_gpr_rdata3/s_axi_aclk] \
  [get_bd_pins axi_gpio_gpr_wen/s_axi_aclk] [get_bd_pins axi_gpio_gpr_wen1/s_axi_aclk] \
  [get_bd_pins axi_gpio_gpr_wen2/s_axi_aclk] [get_bd_pins axi_gpio_gpr_wen3/s_axi_aclk] \
  [get_bd_pins axi_gpio_gpr_wr/s_axi_aclk] [get_bd_pins axi_gpio_gpr_wr1/s_axi_aclk] \
  [get_bd_pins axi_gpio_gpr_wr2/s_axi_aclk] [get_bd_pins axi_gpio_gpr_wr3/s_axi_aclk] [get_bd_pins ps8_0_axi_periph/ACLK] \
  [get_bd_pins ps8_0_axi_periph/M00_ACLK] [get_bd_pins ps8_0_axi_periph/M01_ACLK] [get_bd_pins ps8_0_axi_periph/M02_ACLK] \
  [get_bd_pins ps8_0_axi_periph/M03_ACLK] [get_bd_pins ps8_0_axi_periph/M04_ACLK] [get_bd_pins ps8_0_axi_periph/M05_ACLK] \
  [get_bd_pins ps8_0_axi_periph/M06_ACLK] [get_bd_pins ps8_0_axi_periph/M07_ACLK] [get_bd_pins ps8_0_axi_periph/M08_ACLK] \
  [get_bd_pins ps8_0_axi_periph/M09_ACLK] [get_bd_pins ps8_0_axi_periph/M10_ACLK] [get_bd_pins ps8_0_axi_periph/M11_ACLK] \
  [get_bd_pins ps8_0_axi_periph/M12_ACLK] [get_bd_pins ps8_0_axi_periph/M13_ACLK] [get_bd_pins ps8_0_axi_periph/M14_ACLK] \
  [get_bd_pins ps8_0_axi_periph/M15_ACLK] [get_bd_pins ps8_0_axi_periph/M16_ACLK] [get_bd_pins ps8_0_axi_periph/M17_ACLK] \
  [get_bd_pins ps8_0_axi_periph/M18_ACLK] [get_bd_pins ps8_0_axi_periph/M19_ACLK] [get_bd_pins ps8_0_axi_periph/M20_ACLK] \
  [get_bd_pins ps8_0_axi_periph/M21_ACLK] [get_bd_pins ps8_0_axi_periph/M22_ACLK] [get_bd_pins ps8_0_axi_periph/M23_ACLK] \
  [get_bd_pins ps8_0_axi_periph/M24_ACLK] [get_bd_pins ps8_0_axi_periph/M25_ACLK] [get_bd_pins ps8_0_axi_periph/M26_ACLK] \
  [get_bd_pins ps8_0_axi_periph/M27_ACLK] [get_bd_pins ps8_0_axi_periph/M28_ACLK] [get_bd_pins ps8_0_axi_periph/M29_ACLK] \
  [get_bd_pins ps8_0_axi_periph/M30_ACLK] [get_bd_pins ps8_0_axi_periph/M31_ACLK] [get_bd_pins ps8_0_axi_periph/S00_ACLK] \
  [get_bd_pins rst_ps8_0_99M/slowest_sync_clk] [get_bd_pins zynq_ultra_ps_e_0/maxihpm0_lpd_aclk]
connect_bd_net [get_bd_pins zynq_ultra_ps_e_0/pl_resetn0] \
  [get_bd_ports ps_user1_reset_n] [get_bd_ports ps_user2_reset_n] [get_bd_ports ps_user3_reset_n] \
  [get_bd_ports ps_user_reset_n] [get_bd_pins rst_ps8_0_99M/ext_reset_in]

# ---- address map ----
assign_bd_address -offset 0x0080000000 -range 64K -target_address_space [get_bd_addr_spaces zynq_ultra_ps_e_0/Data] [get_bd_addr_segs axi_gpio_alu_operand/S_AXI/Reg]
assign_bd_address -offset 0x0080010000 -range 64K -target_address_space [get_bd_addr_spaces zynq_ultra_ps_e_0/Data] [get_bd_addr_segs axi_gpio_alu_op/S_AXI/Reg]
assign_bd_address -offset 0x0080020000 -range 64K -target_address_space [get_bd_addr_spaces zynq_ultra_ps_e_0/Data] [get_bd_addr_segs axi_gpio_alu_res/S_AXI/Reg]
assign_bd_address -offset 0x0080030000 -range 64K -target_address_space [get_bd_addr_spaces zynq_ultra_ps_e_0/Data] [get_bd_addr_segs axi_gpio_gpr_wr/S_AXI/Reg]
assign_bd_address -offset 0x0080040000 -range 64K -target_address_space [get_bd_addr_spaces zynq_ultra_ps_e_0/Data] [get_bd_addr_segs axi_gpio_gpr_wen/S_AXI/Reg]
assign_bd_address -offset 0x0080050000 -range 64K -target_address_space [get_bd_addr_spaces zynq_ultra_ps_e_0/Data] [get_bd_addr_segs axi_gpio_gpr_raddr/S_AXI/Reg]
assign_bd_address -offset 0x0080060000 -range 64K -target_address_space [get_bd_addr_spaces zynq_ultra_ps_e_0/Data] [get_bd_addr_segs axi_gpio_gpr_rdata/S_AXI/Reg]
assign_bd_address -offset 0x0080070000 -range 64K -target_address_space [get_bd_addr_spaces zynq_ultra_ps_e_0/Data] [get_bd_addr_segs axi_gpio_alu_operand1/S_AXI/Reg]
assign_bd_address -offset 0x0080080000 -range 64K -target_address_space [get_bd_addr_spaces zynq_ultra_ps_e_0/Data] [get_bd_addr_segs axi_gpio_alu_op1/S_AXI/Reg]
assign_bd_address -offset 0x0080090000 -range 64K -target_address_space [get_bd_addr_spaces zynq_ultra_ps_e_0/Data] [get_bd_addr_segs axi_gpio_alu_res1/S_AXI/Reg]
assign_bd_address -offset 0x00800A0000 -range 64K -target_address_space [get_bd_addr_spaces zynq_ultra_ps_e_0/Data] [get_bd_addr_segs axi_gpio_gpr_wr1/S_AXI/Reg]
assign_bd_address -offset 0x00800B0000 -range 64K -target_address_space [get_bd_addr_spaces zynq_ultra_ps_e_0/Data] [get_bd_addr_segs axi_gpio_gpr_wen1/S_AXI/Reg]
assign_bd_address -offset 0x00800C0000 -range 64K -target_address_space [get_bd_addr_spaces zynq_ultra_ps_e_0/Data] [get_bd_addr_segs axi_gpio_gpr_raddr1/S_AXI/Reg]
assign_bd_address -offset 0x00800D0000 -range 64K -target_address_space [get_bd_addr_spaces zynq_ultra_ps_e_0/Data] [get_bd_addr_segs axi_gpio_gpr_rdata1/S_AXI/Reg]
assign_bd_address -offset 0x00800E0000 -range 64K -target_address_space [get_bd_addr_spaces zynq_ultra_ps_e_0/Data] [get_bd_addr_segs axi_gpio_alu_op2/S_AXI/Reg]
assign_bd_address -offset 0x0080100000 -range 64K -target_address_space [get_bd_addr_spaces zynq_ultra_ps_e_0/Data] [get_bd_addr_segs axi_gpio_alu_operand2/S_AXI/Reg]
assign_bd_address -offset 0x0080110000 -range 64K -target_address_space [get_bd_addr_spaces zynq_ultra_ps_e_0/Data] [get_bd_addr_segs axi_gpio_alu_res2/S_AXI/Reg]
assign_bd_address -offset 0x0080120000 -range 64K -target_address_space [get_bd_addr_spaces zynq_ultra_ps_e_0/Data] [get_bd_addr_segs axi_gpio_gpr_wr2/S_AXI/Reg]
assign_bd_address -offset 0x0080130000 -range 64K -target_address_space [get_bd_addr_spaces zynq_ultra_ps_e_0/Data] [get_bd_addr_segs axi_gpio_gpr_wen2/S_AXI/Reg]
assign_bd_address -offset 0x0080140000 -range 64K -target_address_space [get_bd_addr_spaces zynq_ultra_ps_e_0/Data] [get_bd_addr_segs axi_gpio_gpr_raddr2/S_AXI/Reg]
assign_bd_address -offset 0x0080150000 -range 64K -target_address_space [get_bd_addr_spaces zynq_ultra_ps_e_0/Data] [get_bd_addr_segs axi_gpio_gpr_rdata2/S_AXI/Reg]
assign_bd_address -offset 0x00801F0000 -range 64K -target_address_space [get_bd_addr_spaces zynq_ultra_ps_e_0/Data] [get_bd_addr_segs axi_gpio_alu_op3/S_AXI/Reg]
assign_bd_address -offset 0x0080200000 -range 64K -target_address_space [get_bd_addr_spaces zynq_ultra_ps_e_0/Data] [get_bd_addr_segs axi_gpio_alu_operand3/S_AXI/Reg]
assign_bd_address -offset 0x0080210000 -range 64K -target_address_space [get_bd_addr_spaces zynq_ultra_ps_e_0/Data] [get_bd_addr_segs axi_gpio_alu_res3/S_AXI/Reg]
assign_bd_address -offset 0x0080220000 -range 64K -target_address_space [get_bd_addr_spaces zynq_ultra_ps_e_0/Data] [get_bd_addr_segs axi_gpio_gpr_wr3/S_AXI/Reg]
assign_bd_address -offset 0x0080230000 -range 64K -target_address_space [get_bd_addr_spaces zynq_ultra_ps_e_0/Data] [get_bd_addr_segs axi_gpio_gpr_wen3/S_AXI/Reg]
assign_bd_address -offset 0x0080240000 -range 64K -target_address_space [get_bd_addr_spaces zynq_ultra_ps_e_0/Data] [get_bd_addr_segs axi_gpio_gpr_raddr3/S_AXI/Reg]
assign_bd_address -offset 0x0080250000 -range 64K -target_address_space [get_bd_addr_spaces zynq_ultra_ps_e_0/Data] [get_bd_addr_segs axi_gpio_gpr_rdata3/S_AXI/Reg]
assign_bd_address -offset 0x0080400000 -range 4M -target_address_space [get_bd_addr_spaces zynq_ultra_ps_e_0/Data] [get_bd_addr_segs mips_cpu_axi_if/Reg]
assign_bd_address -offset 0x0080800000 -range 4M -target_address_space [get_bd_addr_spaces zynq_ultra_ps_e_0/Data] [get_bd_addr_segs mips1_cpu_axi_if/Reg]
assign_bd_address -offset 0x0080C00000 -range 4M -target_address_space [get_bd_addr_spaces zynq_ultra_ps_e_0/Data] [get_bd_addr_segs mips2_cpu_axi_if/Reg]
assign_bd_address -offset 0x0081000000 -range 4M -target_address_space [get_bd_addr_spaces zynq_ultra_ps_e_0/Data] [get_bd_addr_segs mips3_cpu_axi_if/Reg]

validate_bd_design
save_bd_design
